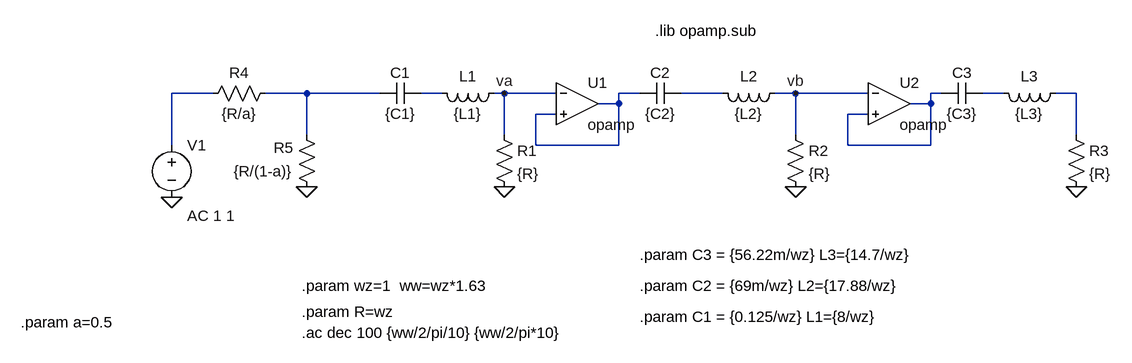
[diagram p0: schematic pasivo.asc]
pasivo.asc, the LTspice schematic file:
Version 4
SHEET 1 1488 680
WIRE -272 160 -336 160
WIRE -128 160 -192 160
WIRE -16 160 -128 160
WIRE 80 160 48 160
WIRE 176 160 160 160
WIRE 256 160 176 160
WIRE 384 160 352 160
WIRE 512 160 448 160
WIRE 624 160 592 160
WIRE 736 160 624 160
WIRE 848 160 832 160
WIRE 944 160 912 160
WIRE 1056 160 1024 160
WIRE 352 176 352 160
WIRE 352 176 320 176
WIRE 832 176 832 160
WIRE 832 176 800 176
WIRE 256 192 224 192
WIRE 736 192 704 192
WIRE -128 224 -128 160
WIRE 176 224 176 160
WIRE 624 224 624 160
WIRE 1056 224 1056 160
WIRE -336 240 -336 160
WIRE 224 240 224 192
WIRE 352 240 352 176
WIRE 352 240 224 240
WIRE 704 240 704 192
WIRE 832 240 832 176
WIRE 832 240 704 240
FLAG -336 320 0
FLAG 176 304 0
FLAG 624 304 0
FLAG 1056 304 0
FLAG 624 160 vb
FLAG 176 160 va
FLAG -128 304 0
SYMBOL cap 48 144 R90
WINDOW 0 0 32 VBottom 2
WINDOW 3 32 32 VTop 2
SYMATTR InstName C1
SYMATTR Value {C1}
SYMBOL ind 176 144 R90
WINDOW 0 5 56 VBottom 2
WINDOW 3 32 56 VTop 2
SYMATTR InstName L1
SYMATTR Value {L1}
SYMBOL res 160 208 R0
SYMATTR InstName R1
SYMATTR Value {R}
SYMBOL cap 448 144 R90
WINDOW 0 0 32 VBottom 2
WINDOW 3 32 32 VTop 2
SYMATTR InstName C2
SYMATTR Value {C2}
SYMBOL ind 608 144 R90
WINDOW 0 5 56 VBottom 2
WINDOW 3 32 56 VTop 2
SYMATTR InstName L2
SYMATTR Value {L2}
SYMBOL res 608 208 R0
SYMATTR InstName R2
SYMATTR Value {R}
SYMBOL cap 912 144 R90
WINDOW 0 0 32 VBottom 2
WINDOW 3 32 32 VTop 2
SYMATTR InstName C3
SYMATTR Value {C3}
SYMBOL OpAmps\\opamp 288 112 R0
SYMATTR InstName U1
SYMBOL voltage -336 224 R0
WINDOW 123 24 124 Left 2
WINDOW 39 0 0 Left 0
SYMATTR Value2 AC 1 1
SYMATTR InstName V1
SYMATTR Value ""
SYMBOL OpAmps\\opamp 768 112 R0
SYMATTR InstName U2
SYMBOL ind 1040 144 R90
WINDOW 0 5 56 VBottom 2
WINDOW 3 32 56 VTop 2
SYMATTR InstName L3
SYMATTR Value {L3}
SYMBOL res 1040 208 R0
SYMATTR InstName R3
SYMATTR Value {R}
SYMBOL res -176 144 R90
WINDOW 0 0 56 VBottom 2
WINDOW 3 32 56 VTop 2
SYMATTR InstName R4
SYMATTR Value {R/a}
SYMBOL res -112 320 R180
WINDOW 0 36 76 Left 2
WINDOW 3 36 40 Left 2
SYMATTR InstName R5
SYMATTR Value {R/(1-a)}
TEXT 384 408 Left 2 !.param C3 = {56.22m/wz} L3={14.7/wz}
TEXT 384 456 Left 2 !.param C2 = {69m/wz} L2={17.88/wz}
TEXT -136 496 Left 2 !.param R=wz
TEXT -136 456 Left 2 !.param wz=1  ww=wz*1.63
TEXT 384 504 Left 2 !.param C1 = {0.125/wz} L1={8/wz}
TEXT -136 528 Left 2 !.ac dec 100 {ww/2/pi/10} {ww/2/pi*10}
TEXT 408 64 Left 2 !.lib opamp.sub
TEXT -568 512 Left 2 !.param a=0.5

The netlist it stands for:
* pasivo.asc
C1 N003 N002 {C1}
L1 va N003 {L1}
R1 va 0 {R}
C2 N005 N004 {C2}
L2 vb N005 {L2}
R2 vb 0 {R}
C3 N007 N006 {C3}
XU1 va N004 N004 opamp Aol=100K GBW=10Meg  ; pins invin noninvin out
V1 N001 0 AC 1 1
XU2 vb N006 N006 opamp Aol=100K GBW=10Meg  ; pins invin noninvin out
L3 N008 N007 {L3}
R3 N008 0 {R}
R4 N002 N001 {R/a}
R5 0 N002 {R/(1-a)}
.param C3 = {56.22m/wz} L3={14.7/wz}
.param C2 = {69m/wz} L2={17.88/wz}
.param R=wz
.param wz=1  ww=wz*1.63
.param C1 = {0.125/wz} L1={8/wz}
.ac dec 100 {ww/2/pi/10} {ww/2/pi*10}
.lib opamp.sub
.param a=0.5
.backanno
.end

* Results of the author's LTspice run, read from the files saved beside the schematic
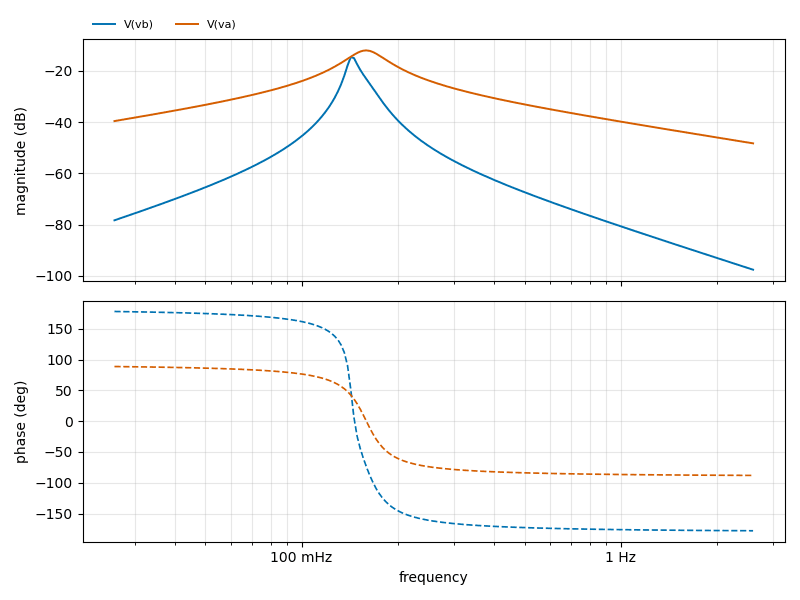
[diagram p1: AC Analysis of pasivo.asc, plotted from the saved traces]
* AC Analysis, 1 run:
*   V(vb): -78.30 dB at 25.94 mHz, -97.56 dB at 2.594 Hz, peak -14.67 dB at 142.6 mHz, 3 dB below the peak at 139.6 mHz and 149.6 mHz
*   V(va): -39.61 dB at 25.94 mHz, -48.29 dB at 2.594 Hz, peak -12.05 dB at 160 mHz, 3 dB below the peak at 140.5 mHz and 180.3 mHz